# Altium schematic sheet cheating-calc.SchDoc
size 297 x 209 mm
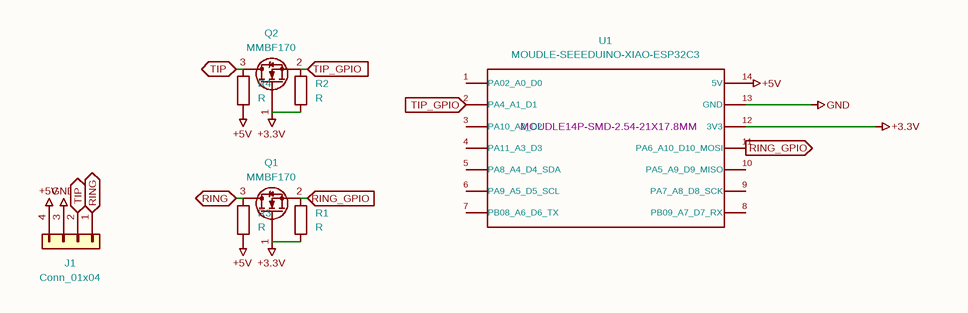
[diagram p0: cheating-calc.SchDoc]

## Parts
J1  Conn_01x04  [PinHeader_1x04_P2.54mm_Vertical]
Q1  MMBF170  [SOT-23]
Q2  MMBF170  [SOT-23]
R1  R  [R_Axial_DIN0207_L6.3mm_D2.5mm_P10.16mm_Horizontal]
R2  R  [R_Axial_DIN0207_L6.3mm_D2.5mm_P10.16mm_Horizontal]
R3  R  [R_Axial_DIN0207_L6.3mm_D2.5mm_P10.16mm_Horizontal]
R4  R  [R_Axial_DIN0207_L6.3mm_D2.5mm_P10.16mm_Horizontal]
U1  MOUDLE-SEEEDUINO-XIAO-ESP32C3  [MOUDLE14P-SMD-2.54-21X17.8MM]

## Ports
RING (bidir), RING_GPIO (in), TIP (bidir), TIP_GPIO (in)

## Nets
+3.3V: Q1.1(G) Q2.1(G) R1.1 R2.1 U1.12(3V3)
+5V: J1.4(Pin_4) R3.1 R4.1 U1.14(5V)
GND: J1.3(Pin_3) U1.13(GND)
RING: J1.1(Pin_1) Q1.3(D) R3.2 ; port RING
RING_GPIO: Q1.2(S) R1.2 U1.11(PA6_A10_D10_MOSI) ; port RING_GPIO
TIP: J1.2(Pin_2) Q2.3(D) R4.2 ; port TIP
TIP_GPIO: Q2.2(S) R2.2 U1.2(PA4_A1_D1) ; port TIP_GPIO

Not connected (* = marked no-connect by the designer): U1 1(PA02_A0_D0) 3(PA10_A2_D2) 4(PA11_A3_D3) 5(PA8_A4_D4_SDA) 6(PA9_A5_D5_SCL) 7(PB08_A6_D6_TX) 8(PB09_A7_D7_RX) 9(PA7_A8_D8_SCK) 10(PA5_A9_D9_MISO)

## Notes on the sheet
- 1
- 2
- 3
- 4
- 5
- 6
- A
- B
- C
- D
- Title:
- File: cheating-calc.kicad_sch
- Sheet: /
- KiCad E.D.A.  kicad (5.1.4)-1
- Size: A4
- Date:
- Rev:
- Id: 1/1

## Library data of the parts
J1 = Conn_01x04: Value: Conn_01x04; Footprint: Connector_PinHeader_2.54mm:PinHeader_1x04_P2.54mm_Vertical
Q1 Q2 = MMBF170: Value: MMBF170; Footprint: Package_TO_SOT_SMD:SOT-23
R1-R4 = R: Value: R; Footprint: Resistor_THT:R_Axial_DIN0207_L6.3mm_D2.5mm_P10.16mm_Horizontal
U1 = MOUDLE-SEEEDUINO-XIAO-ESP32C3: Value: MOUDLE-SEEEDUINO-XIAO-ESP32C3